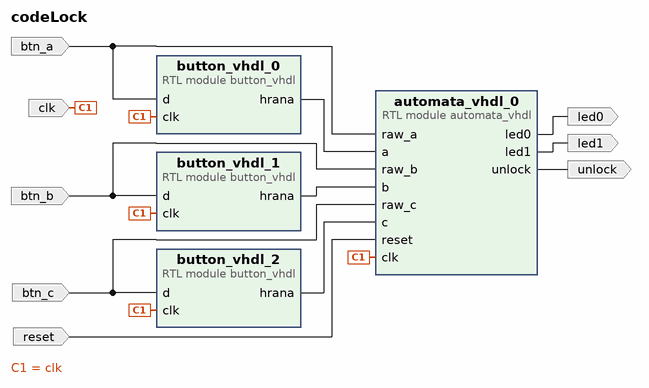
[diagram p0: block diagram of the top level]
# Vivado block design codeLock, xc7a35tcpg236-1, Vivado 2018.3
create_bd_design codeLock

create_bd_port -dir I btn_a
create_bd_port -dir I btn_b
create_bd_port -dir I btn_c
create_bd_port -dir I clk
create_bd_port -dir I reset
create_bd_port -dir O led0
create_bd_port -dir O led1
create_bd_port -dir O unlock

create_bd_cell -type module -reference button_vhdl button_vhdl_0
create_bd_cell -type module -reference automata_vhdl automata_vhdl_0
create_bd_cell -type module -reference button_vhdl button_vhdl_1
create_bd_cell -type module -reference button_vhdl button_vhdl_2

# ---- connections ----

connect_bd_net [get_bd_ports btn_a] [get_bd_pins button_vhdl_0/d] [get_bd_pins automata_vhdl_0/raw_a]
connect_bd_net [get_bd_ports btn_b] [get_bd_pins automata_vhdl_0/raw_b] [get_bd_pins button_vhdl_1/d]
connect_bd_net [get_bd_ports btn_c] [get_bd_pins automata_vhdl_0/raw_c] [get_bd_pins button_vhdl_2/d]
connect_bd_net [get_bd_ports clk] \
  [get_bd_pins button_vhdl_0/clk] [get_bd_pins automata_vhdl_0/clk] [get_bd_pins button_vhdl_1/clk] \
  [get_bd_pins button_vhdl_2/clk]
connect_bd_net [get_bd_pins button_vhdl_0/hrana] [get_bd_pins automata_vhdl_0/a]
connect_bd_net [get_bd_pins button_vhdl_1/hrana] [get_bd_pins automata_vhdl_0/b]
connect_bd_net [get_bd_pins button_vhdl_2/hrana] [get_bd_pins automata_vhdl_0/c]
connect_bd_net [get_bd_ports reset] [get_bd_pins automata_vhdl_0/reset]
connect_bd_net [get_bd_pins automata_vhdl_0/led0] [get_bd_ports led0]
connect_bd_net [get_bd_pins automata_vhdl_0/led1] [get_bd_ports led1]
connect_bd_net [get_bd_pins automata_vhdl_0/unlock] [get_bd_ports unlock]

validate_bd_design
save_bd_design
